# EAGLE design AudioSense-Pi (EAGLE 9.2.0)
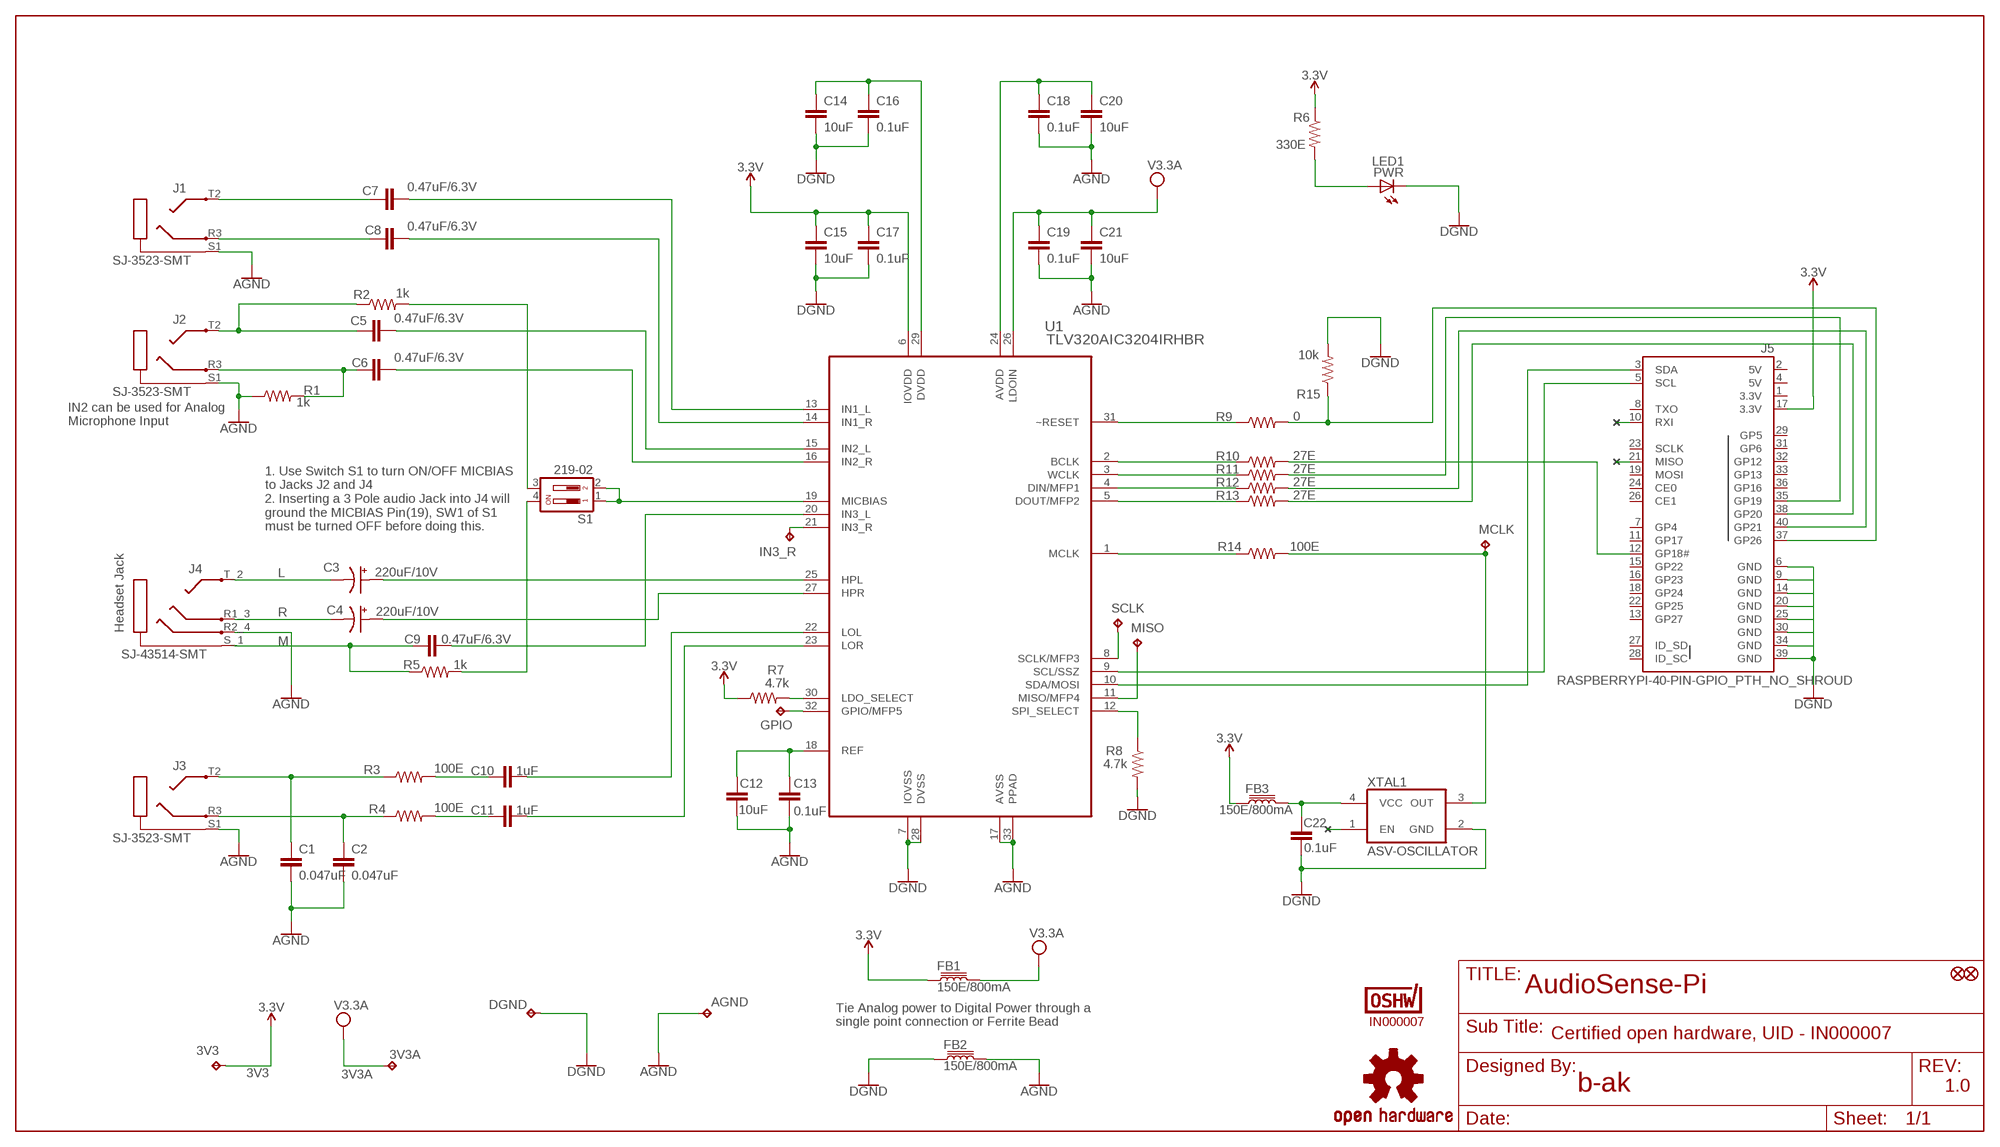
[diagram p0: schematic, sheet 1]

## Parts
3V3  TPB1,27  [B1,27]
3V3A  TPB1,27  [B1,27]
AGND  TPB1,27  [B1,27]
C1  0.047uF  C-EUC1206  [C1206]
C2  0.047uF  C-EUC1206  [C1206]
C3  220uF/10V  T491D107M006AT  [D]
C4  220uF/10V  T491D107M006AT  [D]
C5  0.47uF/6.3V  C-EUC1206  [C1206]
C6  0.47uF/6.3V  C-EUC1206  [C1206]
C7  0.47uF/6.3V  C-EUC1206  [C1206]
C8  0.47uF/6.3V  C-EUC1206  [C1206]
C9  0.47uF/6.3V  C-EUC1206  [C1206]
C10  1uF  C-EUC1206  [C1206]
C11  1uF  C-EUC1206  [C1206]
C12  10uF  C-EUC1206  [C1206]
C13  0.1uF  C-EUC1206  [C1206]
C14  10uF  C-EUC1206  [C1206]
C15  10uF  C-EUC1206  [C1206]
C16  0.1uF  C-EUC1206  [C1206]
C17  0.1uF  C-EUC1206  [C1206]
C18  0.1uF  C-EUC1206  [C1206]
C19  0.1uF  C-EUC1206  [C1206]
C20  10uF  C-EUC1206  [C1206]
C21  10uF  C-EUC1206  [C1206]
C22  0.1uF  C-EUC1206  [C1206]
DGND  TPB1,27  [B1,27]
FB1  150E/800mA  FERRITE_0805MP  [_0805MP]
FB2  150E/800mA  FERRITE_0805MP  [_0805MP]
FB3  150E/800mA  FERRITE_0805MP  [_0805MP]
FID1  FIDUCIAL""  [FIDUCIAL_1MM]
FID2  FIDUCIAL""  [FIDUCIAL_1MM]
GPIO  TPB1,27  [B1,27]
IN3_R  TPB1,27  [B1,27]
J1  SJ-3523-SMT  [SJ-3523-SMT]
J2  SJ-3523-SMT  [SJ-3523-SMT]
J3  SJ-3523-SMT  [SJ-3523-SMT]
J4  SJ-43514-SMT  [SJ-43514-SMT]
J5  RASPBERRYPI-40-PIN-GPIO_PTH_NO_SHROUD  [2X20]
LOGO2  OSHW-LOGOM  [OSHW-LOGO-M]
MCLK  TPB1,27  [B1,27]
MISO  TPB1,27  [B1,27]
PWR  LED1  LEDCHIP-LED0805  [CHIP-LED0805]
R1  1k  RESISTOR1206  [1206]
R2  1k  RESISTOR1206  [1206]
R3  100E  RESISTOR1206  [1206]
R4  100E  RESISTOR1206  [1206]
R5  1k  RESISTOR1206  [1206]
R6  330E  RESISTOR1206  [1206]
R7  4.7k  RESISTOR1206  [1206]
R8  4.7k  RESISTOR1206  [1206]
R9  0  RESISTOR1206  [1206]
R10  27E  RESISTOR1206  [1206]
R11  27E  RESISTOR1206  [1206]
R12  27E  RESISTOR1206  [1206]
R13  27E  RESISTOR1206  [1206]
R14  100E  RESISTOR1206  [1206]
R15  10k  RESISTOR1206  [1206]
S1  219-02  [CTS-219-02]
SCLK  TPB1,27  [B1,27]
U1  TLV320AIC3204IRHBR  [QFN50P500X500X100-33N]
U$6  IN000007  CERT-SMALL  [CERT-SMALL-SILK]
XTAL1  ASV-OSCILLATOR  [OSCILLATOR_7X5_SMD]

## Nets
3POLE_MBIAS: R2.2 S1.3
3V3: 3V3.TP C15.1 C17.1 FB1.1 FB3.1 J5.17(3.3V) R6.1 R7.1 U1.6(IOVDD) ; supply symbol labelled 3.3V
3V3A: 3V3A.TP C19.1 C21.1 FB1.2 U1.26(LDOIN) ; supply symbol labelled V3.3A
4POLE_MBIAS: R5.2 S1.4
AGND: AGND.TP C1.2 C2.2 C12.2 C13.2 C18.2 C19.2 C20.2 C21.2 FB2.2 J1.S1 J2.S1 J3.S1 J4.R2_4 R1.1 U1.17(AVSS) U1.33(PPAD)
AIC_LINE_LOUT_1: C10.1 R3.2
AIC_LINE_ROUT_1: C11.1 R4.2
AVDD: C18.1 C20.1 U1.24(AVDD)
BCLK: R10.1 U1.2(BCLK)
DIN: R12.1 U1.4(DIN/MFP1)
DOUT: R13.1 U1.5(DOUT/MFP2)
DVDD: C14.1 C16.1 U1.29(DVDD)
GND: C14.2 C15.2 C16.2 C17.2 C22.2 DGND.TP FB2.1 J5.6(GND) J5.9(GND) J5.14(GND) J5.20(GND) J5.25(GND) J5.30(GND) J5.34(GND) J5.39(GND) PWR.C R8.2 R15.2 U1.7(IOVSS) U1.28(DVSS) XTAL1.2(GND) ; supply symbol labelled DGND
GP_26: J5.37(GP26) R9.2 R15.1
GPIO: GPIO.TP U1.32(GPIO/MFP5)
HPL: C3.+(A) U1.25(HPL)
HPR: C4.+(A) U1.27(HPR)
IN1_RING: C8.1 J1.R3
IN1_TIP: C7.1 J1.T2
IN1L: C7.2 U1.13(IN1_L)
IN1R: C8.2 U1.14(IN1_R)
IN2_RING: C6.1 J2.R3 R1.2
IN2_TIP: C5.1 J2.T2 R2.1
IN2L: C5.2 U1.15(IN2_L)
IN2R: C6.2 U1.16(IN2_R)
IN3_R: IN3_R.TP U1.21(IN3_R)
IN3L: C9.2 U1.20(IN3_L)
L: C3.-(C) J4.T_2
LDO_SEL: R7.2 U1.30(LDO_SELECT)
LED-A: PWR.A R6.2
LOL: C10.2 U1.22(LOL)
LOR: C11.2 U1.23(LOR)
LOUT_RING: C2.1 J3.R3 R4.1
LOUT_TIP: C1.1 J3.T2 R3.1
M: C9.1 J4.S_1 R5.1
MCLK: R14.1 U1.1(MCLK)
MICBIAS: S1.1 S1.2 U1.19(MICBIAS)
MISO: MISO.TP U1.11(MISO/MFP4)
N$1: XTAL1.1(EN)
N$2: J5.10(RXI)
N$3: J5.21(MISO)
R: C4.-(C) J4.R1_3
REF: C12.1 C13.1 U1.18(REF)
RESET: R9.1 U1.31(~RESET)
RPI_BCLK_PIN12: J5.12(GP18#) R10.2
RPI_DIN_PIN38: J5.38(GP20) R13.2
RPI_DOUT_PIN40: J5.40(GP21) R12.2
RPI_FS_PIN35: J5.35(GP19) R11.2
SCL: J5.5(SCL) U1.9(SCL/SSZ)
SCLK: SCLK.TP U1.8(SCLK/MFP3)
SDA: J5.3(SDA) U1.10(SDA/MOSI)
SPI_SEL: R8.1 U1.12(SPI_SELECT)
VCC: C22.1 FB3.2 XTAL1.4(VCC)
WCLK: R11.1 U1.3(WCLK)
XTAL_OUT: MCLK.TP R14.2 XTAL1.3(OUT)
Unconnected: J5.7(GP4) J5.8(TXO) J5.11(GP17) J5.13(GP27) J5.15(GP22) J5.16(GP23) J5.18(GP24) J5.19(MOSI) J5.22(GP25) J5.23(SCLK) J5.24(CE0) J5.26(CE1) J5.27(ID_SD) J5.28(ID_SC) J5.29(GP5) J5.31(GP6) J5.32(GP12) J5.33(GP13) J5.36(GP16)

## Notes on the sheet
- IN2 can be used for Analog 
  Microphone Input
- 1. Use Switch S1 to turn ON/OFF MICBIAS
  to Jacks J2 and J4
  2. Inserting a 3 Pole audio Jack into J4 will
  ground the MICBIAS Pin(19), SW1 of S1
  must be turned OFF before doing this.
- Headset Jack
- Tie Analog power to Digital Power through a 
  single point connection or Ferrite Bead
- Certified open hardware, UID - IN000007
- b-ak | 1.0

## Power pins joined to a net without a drawn wire
3V3: J5.1(3.3V)
5V: J5.2(5V) J5.4(5V)

## Library data of the parts
3V3 3V3A AGND DGND GPIO IN3_R MCLK MISO SCLK = TLV:TP: Test pad
C1 C2 = resistor:C-EU: CAPACITOR, European symbol; DESCRIPTION: CAP CER 0.047UF 10V X7R 1206; MANUFACTURER: AVX Corporation; MANUFACTURER_PART_NUMBER: 1206ZC473KAT2A; PACKAGE: 1206
C3 C4 = Volks73-Kemet:T491?*: Tantalum Surface Mount Capacitor - Standard Tantalum T491 Series Industrial Grade MnO2 Documentation Datasheet <http://www.kemet.com/Lists/ProductCatalog/Attachments/254/KEM_T2005_T491.pdf> Overview The KEMET T491 Series, designed specifially for today’s highly automated surface mount processes and equipment, is the leading choice for surface mount designs. The T491 combines KEMET’s proven solid tantalum technology, acclaimed and respected throughout the world, with the latest in materials, processes and automation, resulting in unsurpassed total performance and value. This product meets or exceeds the requirements of EIA standard 535BAAC. This series is classifid as MSL (Moisture Sensitivity Level) 1 under J STD 020: unlimited flor life time at ≤30°C / 85% RH. The T491 standard terminations are available in 100% matte tin and provide excellent wetting characteristics and compatibility with today's surface mount solder systems. Tin/lead (Sn/Pb) terminations are available upon request for any part number. Gold-plated terminations are also available for use with conductive epoxy attachment processes. Standard packaging of these devices is tape and reel in accordance with EIA 481. This system provides perfect compatibility with all tape-fed placement units. Benefits Meets or exceeds EIA Standard 535BAAC Taped and reeled per EIA 481 Symmetrical, compliant terminations Optional gold-plated terminations Laser-marked case 100% surge current test on C, D, E, U, V, X sizes Halogen free epoxy Capacitance 0.1 µF to 1,000 µF Tolerance ±10%, ±20% Voltage 2.5 – 50 VDC Extended range values Low profie case sizes RoHS Compliant and lead-free terminations (See www.kemet.com for transition information) Operating temperature: -55ºC to +125ºC; CAPACITANCE: 200µF/10V; CATEGORY: Capacitors; DATASHEET: http://www.kemet.com/Lists/ProductCatalog/Attachments/254/KEM_T2005_T491.pdf; DESCRIPTION: CAP TANT 220UF 10V 10% 2917; DOCUMENTATION_LINK: <a href="http://www.kemet.com/Lists/ProductCatalog/Attachments/254/KEM_T2005_T491.pdf">Datasheet</a>; DOCUMENTATION_URL: http://www.kemet.com/Lists/ProductCatalog/Attachments/254/KEM_T2005_T491.pdf; ESR: 800 mOhm; FAMILY: Tantalum Capacitors; FEATURES: General Purpose; HEIGHT-SEATED: 0.122" (3.10mm); LEAD_SPACING: -; LIFETIME_TEMP: 2000 Hrs @ 85°C; MANUFACTURER: KEMET; MANUFACTURER_PART_NUMBER: T491D227K010AT; MANUFACTURER_SIZE_CODE: D; MOUNTING_TYPE: Surface Mount; OPERATING_TEMPERATURE: -55°C ~ 125°C; PACKAGE: 2917 (7343 Metric); PART_NUMBER: T491D107M006AT; SERIES: T491; SIZE: 0.287" L x 0.169" W (7.30mm x 4.30mm); SUPPLIER_ITEM_INFO: http://www.digikey.com/product-detail/en/T491D107M006AT/399-8367-1-ND/3472090; SUPPLIER_ITEM_LINK: <a href="http://www.digikey.com/product-detail/en/T491D107M006AT/399-8367-1-ND/3472090">Details</a>; SUPPLIER_ITEM_NUMBER: 399-8367-1-ND; SUPPLIER_ITEM_URL: http://www.digikey.com/product-detail/en/T491D107M006AT/399-8367-1-ND/3472090; SUPPLIER_LINK: <a href="http://www.digikey.com">Home Page</a>; SUPPLIER_NAME: Digi-Key; SUPPLIER_URL: http://www.digikey.com; TOLERANCE: ±20%; TYPE: Molded; VOLTAGE-RATED: 6.3V
C5-C9 = resistor:C-EU: CAPACITOR, European symbol; DESCRIPTION: CAP CER 0.47UF 16V X7R 1206; MANUFACTURER: Yageo; MANUFACTURER_PART_NUMBER: CC1206KRX7R7BB474; PACKAGE: 1206
C10 C11 = resistor:C-EU: CAPACITOR, European symbol; DESCRIPTION: CAP CER 1UF 16V X7R 1206; MANUFACTURER: Yageo; MANUFACTURER_PART_NUMBER: CC1206JKX7R7BB105; PACKAGE: 1206
C12 C14 C15 C20 C21 = resistor:C-EU: CAPACITOR, European symbol; DESCRIPTION: CAP CER 10UF 16V X7R 1206; MANUFACTURER: Kemet; MANUFACTURER_PART_NUMBER: C1206C106J4RACTU; PACKAGE: 1206
C13 C16-C19 C22 = resistor:C-EU: CAPACITOR, European symbol; DESCRIPTION: CAP CER 0.1UF 16V X7R 1206; MANUFACTURER: Kemet; MANUFACTURER_PART_NUMBER: C1206C104K4RACTU; PACKAGE: 1206
FB1-FB3 = TLV:FERRITE: Ferrite Bead 0603 MMZ1608B121C - 120 Ohm @ 100MHz, 600mA, 0.15 Ohm DC Resistance - Digikey: 445-2164-1-ND BK1608HW121-T - 120 Ohm, 600mA Ferrite Chip - Digikey: 587-1876-2-ND 0805 BLM21AG151SN1D - FERRITE BEAD 150 OHM 0805 1LN (Murrata Electronics) HZ0805B272R-10 - 2.7K Ohm @ 100MHz, 200mA, 0.8 Ohm DC Resistance - Digikey: 240-2504-1-ND (see also Murata BLM21BD272SN1L) MMZ2012Y152B - 1.5K Ohm @ 100MHz, 500mA, 0.4 Ohm DC Resistance - Digikey: 445-1560-1-ND - Mainly for high frequency (80-400MHz) MMZ2012R102A - 1K Ohm @ 100MHz, 500mA, 0.3 Ohm DC Resistance - Digikey: 445-1555-2-ND - More general purpose (10-200MHz); DESCRIPTION: FERRITE BEAD 150 OHM 0805 1LN; MANUFACTURER: Murata Electronics North America; MANUFACTURER_PART_NUMBER: BLM21AG151SN1D; PACKAGE: 0805 (2012 Metric); PART_DESCRIPTION: FERRITE BEAD 150 OHM 0805 1LN; PART_NUMBER: BLM21AG151SN1D
FID1 FID2 = microbuilder:FIDUCIAL: Fiducial Alignment Points Various fiducial points for machine vision alignment.
J1-J3 = TLV:SJ-3523-SMT: 3.5mm Stereo Jack without Tip Switch from CUI Inc; 3D-MODEL: http://www.cui.com/product/resource/3dmodel/sj-3523-smt; DATASHEET: http://www.cui.com/product/resource/sj-352x-smt-series.pdf; DESCRIPTION: CONN JACK STEREO 3.5MM SMD R/A; LINK: https://www.arrow.com/en/products/sj-3523-smt-tr/cui-inc; MANUFACTURER: CUI Inc.; MANUFACTURER_PART_NUMBER: SJ-3523-SMT-TR; PACKAGE: Surface Mount, Right Angle; PART_DESC: 3.5MM Stereo Jack, SMD RA; PART_NUMBER: SJ-3523-SMT
J4 = TLV:SJ-43514-SMT: 4 Conductors (TRRS), 4 Contacts, 3.5mm Stereo Jack from CUI Inc; 3D-MODEL: http://www.cui.com/product/resource/3dmodel/sj-43514-smt; DATASHEET: http://www.cui.com/product/resource/digikeypdf/sj-4351x-smt_series.pdf; DESCRIPTION: CONN JACK 4COND 3.5MM SMD R/A; LINK: https://www.arrow.com/en/products/sj-43516-smt-tr/cui-inc; MANUFACTURER: CUI Inc.; MANUFACTURER_PART_NUMBER: SJ-43514-SMT-TR; PACKAGE: Surface Mount, Right Angle; PART-NUMBER: SJ-43514-SMT-TR
J5 = SparkFun-Connectors:RASPBERRYPI-40-PIN-GPIO: Raspberry Pi GPIO Header 2x20 pin connector, as found on B, B+, A+ models. Both shrouded PTH and SMT versions available. SparkFun Products: GPIO Shrouded Header <https://www.sparkfun.com/products/13054>- PTH SparkFun Pi Wedge (Preassembled) <https://www.sparkfun.com/products/13717>; DESCRIPTION: Stacking Header for Pi A+/B+/Pi 2/Pi 3 - 2x20 Extra Tall Header; MANUFACTURER: Adafruit; MANUFACTURER_PART_NUMBER: 1979; PACKAGE: PTH
LOGO2 = SparkFun-Aesthetics:OSHW-LOGO: Open-Source Hardware (OSHW) Logo This logo indicates the piece of hardware it is found on incorporates a OSHW license and/or adheres to the definition of open source hardware found here: http://freedomdefined.org/OSHW
PWR = adafruit:LED: LED OSRAM: - CHIPLED LG R971, LG N971, LY N971, LG Q971, LY Q971, LO R971, LY R971 LH N974, LH R974 LS Q976, LO Q976, LY Q976 LO Q996 - Hyper CHIPLED LW Q18S LB Q993, LB Q99A, LB R99A - SideLED LS A670, LO A670, LY A670, LG A670, LP A670 LB A673, LV A673, LT A673, LW A673 LH A674 LY A675 LS A676, LA A676, LO A676, LY A676, LW A676 LS A679, LY A679, LG A679 - Hyper Micro SIDELED® LS Y876, LA Y876, LO Y876, LY Y876 LT Y87S - SmartLED LW L88C, LW L88S LB L89C, LB L89S, LG L890 LS L89K, LO L89K, LY L89K LS L896, LA L896, LO L896, LY L896 - TOPLED LS T670, LO T670, LY T670, LG T670, LP T670 LSG T670, LSP T670, LSY T670, LOP T670, LYG T670 LG T671, LOG T671, LSG T671 LB T673, LV T673, LT T673, LW T673 LH T674 LS T676, LA T676, LO T676, LY T676, LB T676, LH T676, LSB T676, LW T676 LB T67C, LV T67C, LT T67C, LS T67K, LO T67K, LY T67K, LW E67C LS E67B, LA E67B, LO E67B, LY E67B, LB E67C, LV E67C, LT E67C LW T67C LS T679, LY T679, LG T679 LS T770, LO T770, LY T770, LG T770, LP T770 LB T773, LV T773, LT T773, LW T773 LH T774 LS E675, LA E675, LY E675, LS T675 LS T776, LA T776, LO T776, LY T776, LB T776 LHGB T686 LT T68C, LB T68C - Hyper Mini TOPLED® LB M676 - Mini TOPLED Santana® LG M470 LS M47K, LO M47K, LY M47K Source: http://www.osram.convergy.de/; DESCRIPTION: LED GREEN CLEAR 1206 SMD; MANUFACTURER: Lite-On Inc.; MANUFACTURER_PART_NUMBER: LTST-C150GKT; PACKAGE: 1206
R1 R2 R5 = SparkFun-Resistors:RESISTOR: Generic Resistor Package; DESCRIPTION: RES SMD 1K OHM 1% 1/4W 1206; MANUFACTURER: Yageo; MANUFACTURER_PART_NUMBER: RC1206FR-071KL; PACKAGE: 1206
R3 R4 R14 = SparkFun-Resistors:RESISTOR: Generic Resistor Package; DESCRIPTION: RES SMD 100 OHM 1% 1/4W 1206; MANUFACTURER: Yageo; MANUFACTURER_PART_NUMBER: RC1206FR-07100RL; PACKAGE: 1206
R6 = SparkFun-Resistors:RESISTOR: Generic Resistor Package; DESCRIPTION: RES SMD 330 OHM 5% 1/4W 1206; MANUFACTURER: Yageo; MANUFACTURER_PART_NUMBER: RC1206JR-07330RL; PACKAGE: 1206
R7 R8 = SparkFun-Resistors:RESISTOR: Generic Resistor Package; DESCRIPTION: RES SMD 4.7K OHM 1% 1/4W 1206; MANUFACTURER: Yageo; MANUFACTURER_PART_NUMBER: RC1206FR-074K7L; PACKAGE: 1206
R9 = SparkFun-Resistors:RESISTOR: Generic Resistor Package; DESCRIPTION: RES SMD 0 OHM JUMPER 1/4W 1206; MANUFACTURER: Yageo; MANUFACTURER_PART_NUMBER: AC1206JR-070RL; PACKAGE: 1206
R10-R13 = SparkFun-Resistors:RESISTOR: Generic Resistor Package; DESCRIPTION: RES SMD 27 OHM 5% 1/4W 1206; MANUFACTURER: Yageo; MANUFACTURER_PART_NUMBER: RC1206JR-0727RL; PACKAGE: 1206
R15 = SparkFun-Resistors:RESISTOR: Generic Resistor Package; DESCRIPTION: RES SMD 10K OHM 1% 1/4W 1206; MANUFACTURER: Yageo; MANUFACTURER_PART_NUMBER: RC1206FR-0710KP; PACKAGE: 1206
S1 = TLV:219-02*: Surface Mount DIP Switch Series 219 SMT CTS Electronic Components Source: www.ctscorp.com; DATASHEET: https://www.ctscorp.com/wp-content/uploads/219.pdf; DESCRIPTION: SWITCH SLIDE DIP SPST 100MA 20V; LINK: https://www.arrow.com/en/products/219-2lpst/cts; MANUFACTURER: CTS Electrocomponents; MANUFACTURER_PART_NUMBER: 219-2LPSTR; PACKAGE: SMT
U1 = TLV:TLV320AIC3204IRHBR: Ultra Low Power Stereo Audio Codec; DESCRIPTION: IC STEREO AUDIO CODEC 1.8V 32QFN; MANUFACTURER: Texas Instruments; MANUFACTURER_PART_NUMBER: TLV320AIC3204IRHBR; MPN: TLV320AIC3204IRHBR; OC_FARNELL: 1682562; OC_NEWARK: 09P8706; PACKAGE: 32-VFQFN Exposed Pad; SUPPLIER: Texas Instruments
U$6 = OSHWA:CERT
XTAL1 = asv-oscillator:ASV-OSCILLATOR: Oscillator; DESCRIPTION: OSC XO 12.000MHZ HCMOS SMD; MANUFACTURER: Abracon LLC; MANUFACTURER_PART_NUMBER: ASV-12.000MHZ-EJ-T; PACKAGE: 1206

## Board
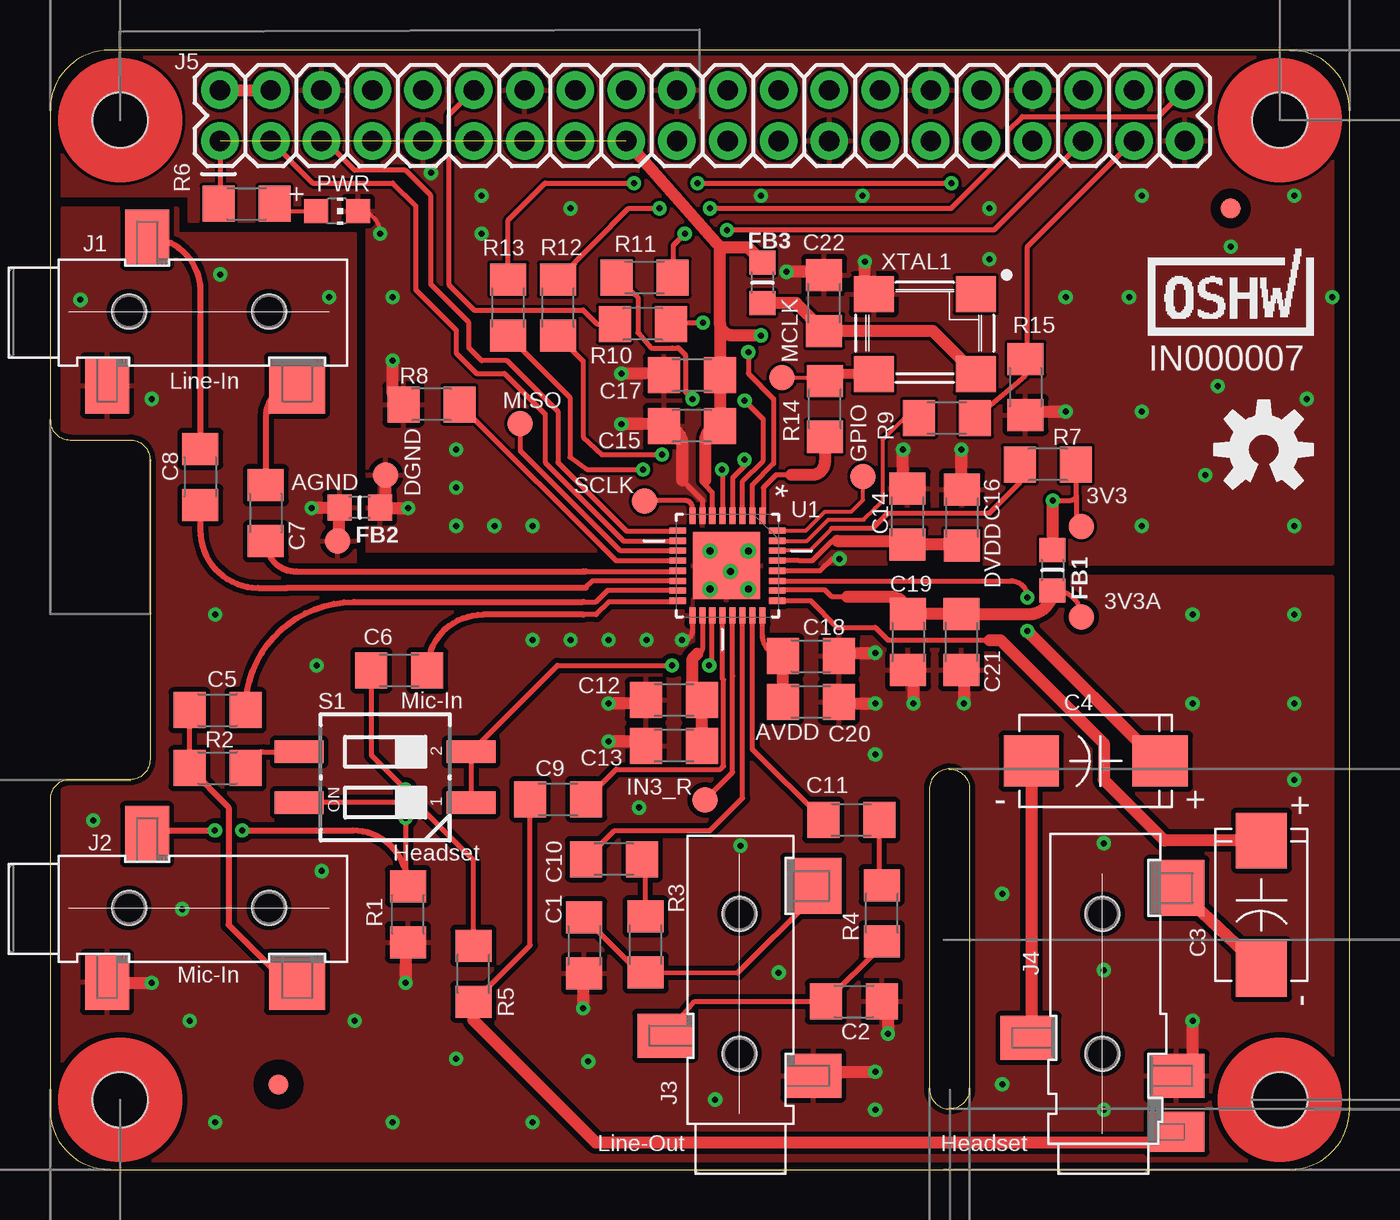
[diagram p1: board, top side]
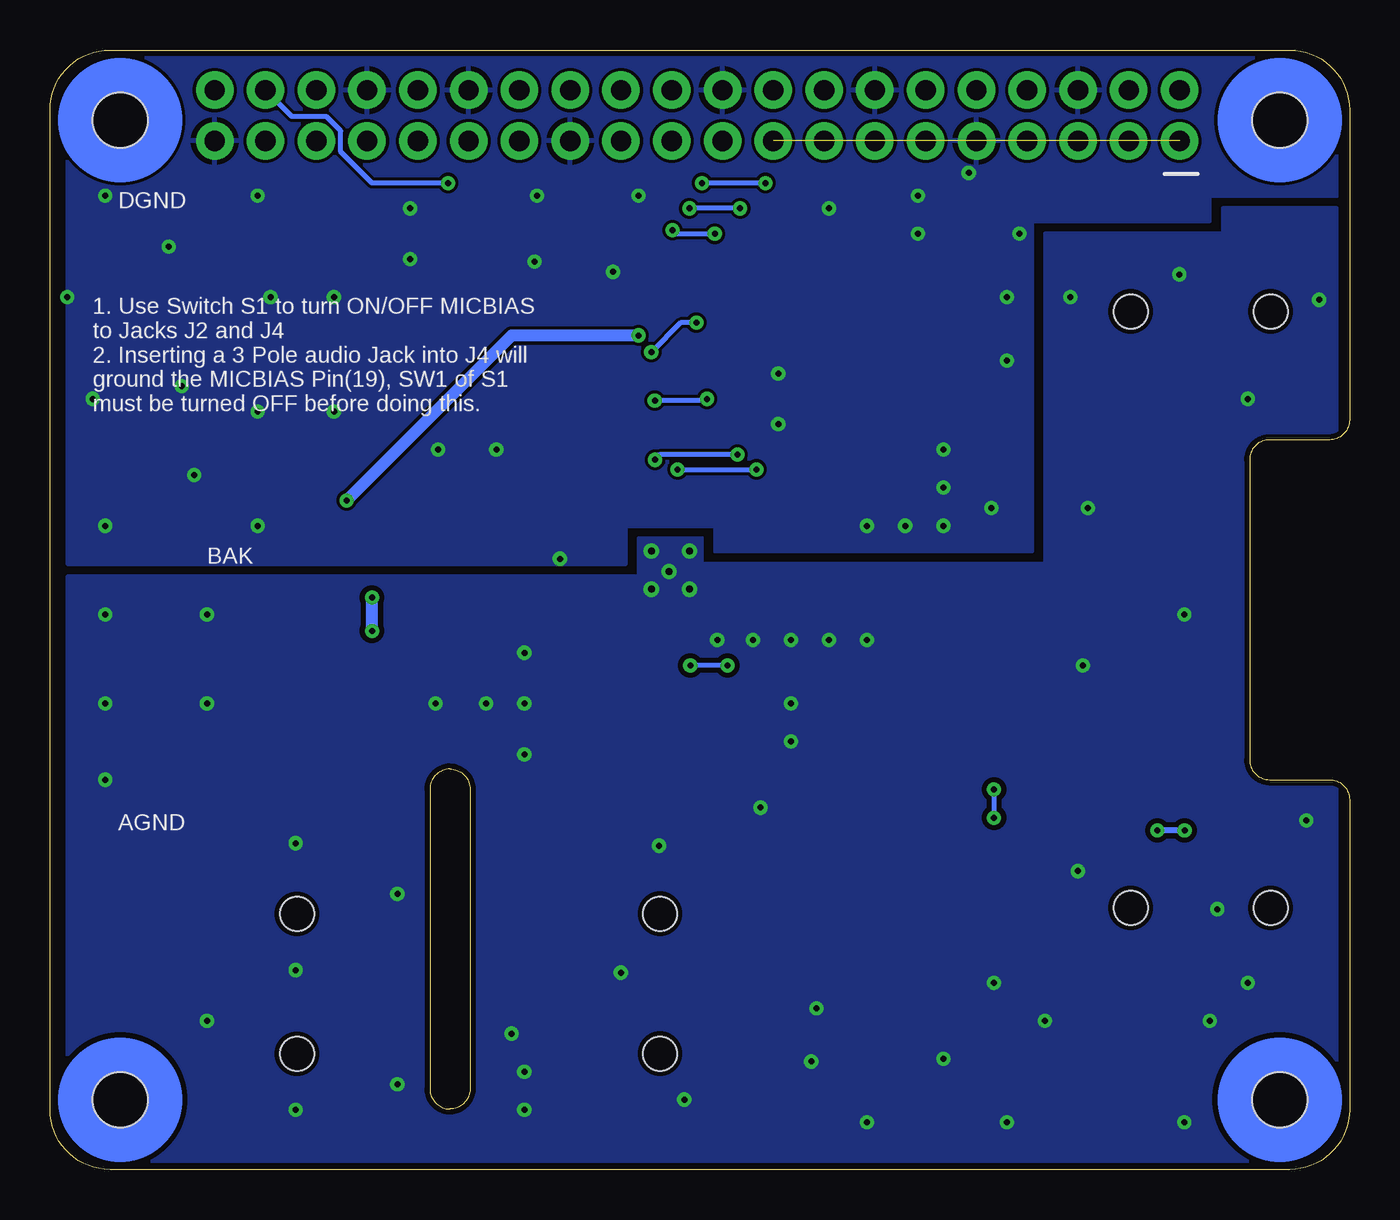
[diagram p2: board, bottom side, seen from below]

Size 65 x 56 mm. Coordinates in mm from the lower left corner, seen from the top.
Outline: 0,53 0,37.5 arc90 1,36.5 4,36.5 arc-90 5,35.5 5,20.5 arc-90 4,19.5 1,19.5 arc90 0,18.5 0,3 arc90 3,0 62,0 arc90 65,3 65,53 arc90 62,56 3,56 arc90 0,53
Outline: 43.99,19.03 43.99,4.03 arc90 44.99,3.03 arc90 45.99,4.03 45.99,19.03 arc90 44.99,20.03 arc90 43.99,19.03
Copper layers (1*16): Top 0.035mm / dielectric 1.5mm / Bottom 0.035mm
Design rules "bc": minimum track width 8mil, minimum drill 0.3mm, track to track 6mil, track to pad 6mil, pad to pad 6mil, via to via 6mil, smd to smd 6mil, copper to edge 10mil, drill to drill 8mil, minimum pad ring 10mil, minimum via ring 8mil, stop-mask expansion 4mil, vias tented up to drill 15mil, thermal gap 10mil
Holes 2.75 mm at 3.5,52.5 61.5,52.5 61.5,3.5 3.5,3.5

### Footprints (pad centres in the part's own frame; a part is rotated, then mirrored left to right if it is on the bottom)
B1,27 = smd 1.27 x 1.27: TP 0,0
C1206 = smd 1.6 x 1.8: 1 -1.4,0; 2 1.4,0
D = smd 2.77 x 2.55: + 3.22,0; - -3.22,0
_0805MP = smd 1.2 x 1.3: 1 -1.016,0; 2 1.016,0
FIDUCIAL_1MM = smd 1 x 1: 1 0,0
SJ-3523-SMT = smd 2.2 x 2.8: R3 -1.5,4.9; S1 -3.5,-2.5 | smd 2.8 x 2.8: T2 6,-2.5 | hole 1.7: 4.6,1.2; -2.4,1.2
SJ-43514-SMT = smd 2.2 x 2.8: R1_3 -0.6,4.9; R2_4 -2.5,-2.5 | smd 2 x 2.8: S_1 -5.3,-2.5 | smd 2.8 x 2.8: T_2 6.9,-2.5 | hole 1.7: 5.6,1.2; -1.4,1.2
2X20 = drill 1.016 pad 1.88: 1 0,0; 2 0,2.54; 3 2.54,0; 4 2.54,2.54; 5 5.08,0; 6 5.08,2.54; 7 7.62,0; 8 7.62,2.54; 9 10.16,0; 10 10.16,2.54; 11 12.7,0; 12 12.7,2.54; 13 15.24,0; 14 15.24,2.54; 15 17.78,0; 16 17.78,2.54; 17 20.32,0; 18 20.32,2.54; 19 22.86,0; 20 22.86,2.54; 21 25.4,0; 22 25.4,2.54; 23 27.94,0; 24 27.94,2.54; 25 30.48,0; 26 30.48,2.54; 27 33.02,0; 28 33.02,2.54; 29 35.56,0; 30 35.56,2.54; 31 38.1,0; 32 38.1,2.54; 33 40.64,0; 34 40.64,2.54; 35 43.18,0; 36 43.18,2.54; 37 45.72,0; 38 45.72,2.54; 39 48.26,0; 40 48.26,2.54
CHIP-LED0805 = smd 1.2 x 1.2: A 0,-1.05; C 0,1.05
1206 = smd 1.6 x 1.8: 1 -1.4,0; 2 1.4,0
CTS-219-02 = smd 1.13 x 2.44: 1 -1.27,-4.3; 2 1.27,-4.3; 3 1.27,4.3; 4 -1.27,4.3
QFN50P500X500X100-33N = smd 0.813 x 0.305: 1 -2.489,1.753; 2 -2.489,1.245; 3 -2.489,0.762; 4 -2.489,0.254; 5 -2.489,-0.254; 6 -2.489,-0.762; 7 -2.489,-1.245; 8 -2.489,-1.753; 17 2.489,-1.753; 18 2.489,-1.245; 19 2.489,-0.762; 20 2.489,-0.254; 21 2.489,0.254; 22 2.489,0.762; 23 2.489,1.245; 24 2.489,1.753 | smd 0.305 x 0.813: 9 -1.753,-2.489; 10 -1.245,-2.489; 11 -0.762,-2.489; 12 -0.254,-2.489; 13 0.254,-2.489; 14 0.762,-2.489; 15 1.245,-2.489; 16 1.753,-2.489; 25 1.753,2.489; 26 1.245,2.489; 27 0.762,2.489; 28 0.254,2.489; 29 -0.254,2.489; 30 -0.762,2.489; 31 -1.245,2.489; 32 -1.753,2.489 | smd 3.353 x 3.353: 33 0,-0.051
OSCILLATOR_7X5_SMD = smd 2 x 1.8: 1 -2.6,-1.9; 2 2.5,-1.9; 3 2.5,2.1; 4 -2.6,2.1

### Placement (x,y rotation side)
3V3  51.59,32.16 0 top
3V3A  51.59,27.64 0 top
AGND  14.38,31.44 0 top
C1  26.72,11.21 270 top
C2  40.21,8.4 0 top
C3  60.59,13.24 90 top
C4  52.31,20.44 0 top
C5  8.38,22.98 0 top
C6  17.46,24.97 0 top
C7  10.79,32.83 270 top
C8  7.51,34.65 270 top
C9  25.42,18.52 0 top
C10  28.2,15.52 180 top
C11  40.08,17.48 180 top
C12  31.21,23.48 180 top
C13  31.21,21.2 180 top
C14  42.89,32.67 90 top
C15  32.11,37.2 180 top
C16  45.62,32.61 90 top
C17  32.11,39.73 180 top
C18  38.07,25.68 0 top
C19  42.92,26.38 270 top
C20  38.06,23.4 0 top
C21  45.58,26.38 270 top
C22  38.71,43.34 90 top
DGND  16.79,34.74 0 top
FB1  50.14,29.98 270 top
FB2  15.49,33.11 180 top
FB3  35.63,44.35 270 top
FID1  59.05,48.08 0 top
FID2  11.43,4.26 0 top
GPIO  40.66,34.66 0 top
IN3_R  32.77,18.48 0 top
J1  6.35,41.72 0 top
J2  6.35,11.88 0 top
J3  35.69,8.2 90 top
J4  53.85,7.18 90 top
J5  8.5,51.45 0 top
LOGO2  60.71,36.01 0 top
MCLK  36.6,39.62 0 top
MISO  23.52,37.31 0 top
PWR  14.35,47.95 270 top
R1  17.91,12.77 90 top
R2  8.38,20.08 0 top
R3  29.79,11.25 90 top
R4  41.6,12.82 90 top
R5  21.18,9.8 90 top
R6  9.83,48.31 0 top
R7  49.91,35.27 180 top
R8  19.09,38.27 180 top
R9  44.87,37.6 0 top
R10  29.65,42.3 180 top
R11  29.75,44.62 0 top
R12  25.41,43.12 90 top
R13  22.92,43.12 90 top
R14  38.76,38.05 90 top
R15  48.79,39.15 270 top
S1  16.76,19.63 90 top
SCLK  29.74,33.44 0 top
U1  33.88,30.2 270 top
U$6  59.05,41.72 0 top
XTAL1  43.71,41.89 180 top

### Tracks (layer width: path | path; a pad name or v marks a point on that pad's centre or on a via)
3POLE_MBIAS
  Top 0.254: R2.2 arc-90 10.62,20.9 S1.3
3V3  (via drill 0.3)  (1 unrouted)
  Top 0.203: 8.5,48.39 arc-90 R6.1
  Top 0.254: v50.16,33.47 51.05,33.47 arc90 51.33,33.75 | 51.33,33.75 R7.1 | U1.6 33.12,33.88 32.77,34.23 32.77,34.49 | J5.1 8.5,48.39 | 51.33,33.75 51.33,32.41 arc90 3V3.TP
  Top 0.61: J5.17 33.51,46.13 | v50.16,33.47 50.16,31.02 FB1.1 | 33.51,46.13 34.88,46.13 FB3.1 | 32.77,34.49 32.77,36.46 arc-90 C15.1 C17.1 33.51,42.36 | 33.51,42.36 33.51,46.13 | v35.56,41.72 34.14,41.72 arc-90 33.51,42.36
  Bottom 0.61: v35.56,41.72 41.91,41.72 v50.16,33.47
3V3A
  Top 0.254: 50.27,28.97 FB1.2 50.27,28.97 | 39.88,28.64 39.12,28.64 38.77,28.99 36.4,28.99 U1.26 | 50.27,28.97 arc-90 3V3A.TP
  Top 0.61: FB1.2 arc-90 48.95,27.78 C21.1 C19.1 arc90 42.05,28.64 39.88,28.64
4POLE_MBIAS
  Top 0.254: R5.2 21.18,15.46 18.29,18.36 S1.4
5V
  Top 0.61: J5.2 J5.4
AGND  (via drill 0.3, 0.35)
  Top 0.254: U1.17 32.13,26.89 arc-90 v31.62,26.48
  Top 0.61: C12.2 29.81,23.31 v27.94,23.31 | C13.2 29.81,21.41 v27.94,21.41 | 14.47,33.09 FB2.2 14.45,33.09 | J1.S1 2.85,39.82 | C18.2 arc-90 39.63,25.85 v41.27,25.85 | C20.2 arc90 39.55,23.31 v41.27,23.31 | C19.2 arc-90 43.18,24.72 v43.18,23.31 | C21.2 arc-90 45.72,24.84 v45.72,23.31 | 14.45,33.09 v13.08,33.09 | R1.1 arc90 17.78,11.22 v17.78,9.34 | J2.S1 arc90 2.89,9.34 v5.08,9.34 | J3.S1 arc90 38.24,4.9 v41.27,4.9 | J4.R2_4 arc90 57.15,5.74 v57.15,7.44 | C2.2 arc-90 41.91,8.1 v41.91,6.8 | C1.2 arc90 26.67,9.76 v26.67,8.07 | U1.33 33.74,30.2 v33.02,30.93 | AGND.TP arc90 14.45,31.52 14.45,33.09
  other vias: 5.08,38.55 34.92,30.93 34.04,29.91 33.02,29.03 34.92,29.03 8.26,27.75 57.15,27.75 62.23,27.75 62.23,23.31 57.15,23.31 62.23,19.5 29.84,26.48 27.94,26.48 26.04,26.48 24.13,26.48 13.34,25.22 6.99,7.44 15.24,7.44 41.27,20.77 20.32,5.53 8.26,2.35 17.14,2.35 24.13,2.35 52.7,2.99 52.7,9.98 52.7,16.33 13.97,43.63 34.54,16.2 36.45,9.85 33.27,3.5 29.46,18.1 13.59,14.93 6.6,13.02 2.16,17.47 8.51,44.77 1.52,43.5 47.62,4.26 47.62,13.78 41.27,2.99 26.92,5.4
  pour Bottom (isolate 0.254): 61.13,0.45 3.63,0.45 arc-90 0.64,3.45 0.64,48.08 6.35,48.08 6.35,46.81 15.24,46.81 15.24,30.3 32.38,30.3 32.38,31.56 35.56,31.56 35.56,29.66 64.14,29.66 64.14,3.45 arc-90
  pour Top (isolate 0.254): 0.64,46.81 0.64,48.08 6.35,48.08 6.35,46.81 15.24,46.81 15.24,30.3 32.38,30.3 32.38,31.56 35.56,31.56 35.56,29.66 64.14,29.66 64.14,3.45 arc-90 61.13,0.45 3.63,0.45 arc-90 0.64,3.45
AIC_LINE_LOUT_1
  Top 0.254: R3.2 29.79,15.34 C10.1
AIC_LINE_ROUT_1
  Top 0.254: R4.2 41.48,14.37 C11.1
AVDD
  Top 0.254: C18.1 arc-90 35.64,26.71 U1.24
  Top 0.61: C20.1 arc90 C20.1 C18.1
BCLK  (via drill 0.3)
  Top 0.203: 36.2,35.38 36.2,35.31
  Top 0.254: R10.1 arc-90 31.14,42.36 v32.67,42.36 | U1.2 35.13,34.24 36.2,35.31 | v34.92,40.89 34.92,39.82 36.2,38.55 36.2,35.38
  Bottom 0.254: v32.67,42.36 33.45,42.36 v34.92,40.89
DIN  (via drill 0.3)
  Top 0.254: R12.1 26.67,40.44 26.67,36.64 27.61,35.76 v30.61,35.76 | U1.4 34.14,34.59 34.73,35.18 v34.73,35.5
  Bottom 0.254: v30.61,35.76 34.48,35.76 arc-90 v34.73,35.5
DOUT  (via drill 0.3)
  Top 0.203: U1.5 arc-90 33.61,32.72
  Top 0.254: R13.1 26.01,38.61 26.01,35.63 26.85,35.02 v29.67,35.02 | U1.5 33.66,32.72 33.66,34.97 arc90 v33.6,35.02
  Bottom 0.254: v33.6,35.02 v29.67,35.02
DVDD
  Top 0.203: 37.63,30.46 37.47,30.46 | 38.85,31.18 38.86,31.18 | 39.12,31.44 39.37,31.44
  Top 0.254: U1.29 37.47,30.46 38.13,30.46 38.85,31.18 | 38.86,31.18 39.12,31.44
  Top 0.61: C16.1 arc90 45.56,31.27 C14.1 arc90 42.72,31.44 39.37,31.44
GND  (via drill 0.3)
  Top 0.203: PWR.C arc-90 16.51,46.84 v16.51,46.81
  Top 0.254: 31.62,34.49 31.88,34.23 31.88,34.22 32.64,33.46 U1.7 | U1.28 38.52,29.95 39.12,30.55 v39.5,30.55
  Top 0.61: C17.2 arc90 30.62,39.82 v28.57,39.82 | v28.57,37.28 30.62,37.28 arc-90 C15.2 arc-90 31.62,36.28 31.62,34.49 | 42.8,34.16 arc90 C14.2 arc-90 42.8,34.16 | 42.8,34.16 arc-90 42.67,34.28 v42.67,36.01 | C16.2 arc-90 45.59,34.04 v45.59,36.01 | C22.2 arc90 38.55,44.9 v36.83,44.9 | XTAL1.2 arc-90 40.77,44.23 v40.77,45.41 | FB2.1 16.53,33.09 v17.91,33.09 | FB2.1 16.79,33.39 | R15.2 48.98,37.92 v50.8,37.92 | R8.2 17.14,38.79 v17.14,40.45 | FB2.1 arc90 16.79,33.39 | 16.79,33.39 DGND.TP
  other vias: 58.42,39.19 64.14,43.63 53.98,43.63 57.78,34.74 62.23,32.2 54.61,37.92 62.87,38.55 54.61,32.2 54.61,48.71 62.23,48.71 59.05,46.17 21.59,48.71 22.23,32.2 17.14,43.63 50.8,43.63 21.59,46.81 20.32,36.01 20.32,32.2 24.13,32.2 20.32,34.11 46.99,45.53 26.04,48.08 40.64,48.71 35.56,48.71 46.99,48.08 19.05,49.85
  pour Bottom: 0.64,48.71 0.64,52.69 arc-90 3.63,55.69 61.13,55.69 arc-90 64.14,52.69 64.14,30.3 36.2,30.3 36.2,32.2 31.75,32.2 31.75,30.93 15.88,30.93 15.88,47.44 6.99,47.44 6.99,48.71
  pour Top: 0.64,48.71 0.64,52.69 arc-90 3.63,55.69 61.13,55.69 arc-90 64.14,52.69 64.14,30.3 36.2,30.3 36.2,32.2 31.75,32.2 31.75,30.93 15.88,30.93 15.88,47.44 6.99,47.44 6.99,48.71
GP_26
  Top 0.254: R9.2 48.77,39.69 R15.1 48.9,40.67 48.9,46.17 54.17,51.45 J5.37
GPIO
  Top 0.203: U1.32 37.81,31.96 38.76,32.91 40.08,32.91 40.66,33.5 GPIO.TP
HPL
  Top 0.254: U1.25 38.04,28.45 39.37,27.12 41.27,27.12 41.91,26.48 46.99,26.48
  Top 0.61: C3.+ 55.75,16.46 52.7,19.5 52.7,21.32 47.54,26.48 46.99,26.48
HPR  (via drill 0.3)
  Top 0.254: v48.9,28.61 arc90 48.07,29.44 U1.27
  Top 0.61: v48.9,26.94 55.4,20.44 C4.+
  Bottom 0.61: v48.9,26.94 v48.9,28.61
IN1_RING
  Top 0.305: J1.R3 arc-90 7.51,43.96 C8.1
IN1_TIP
  Top 0.305: J1.T2 arc90 10.79,37.67 C7.1
IN1L
  Top 0.254: 26.67,29.91 31.36,29.91 U1.13
  Top 0.305: 26.8,29.91 26.67,29.91 12.32,29.91 arc-90 C7.2
IN1R
  Top 0.254: U1.14 27.14,29.44 26.8,29.1
  Top 0.305: 26.8,29.1 11.86,29.1 arc-90 11.86,29.1 10.4,29.1 arc-90 7.51,31.98 C8.2
IN2_RING  (via drill 0.3)
  Top 0.254: C6.1 16.06,20.73 v17.78,19.02 | v17.78,17.59 17.78,14.32 R1.2
  Top 0.305: J2.R3 arc-90 5.03,16.96 v8.25,16.96 | v9.62,16.96 15.14,16.96 arc-90 R1.2
  Bottom 0.254: v17.78,19.02 v17.78,17.59
  Bottom 0.305: v8.25,16.96 v9.62,16.96
IN2_TIP
  Top 0.254: R2.1 arc90 6.98,20.11 C5.1
  Top 0.305: R2.1 8.93,18.11 8.93,12.24 11.8,9.38 J2.T2
IN2L
  Top 0.254: 26.67,28.39 27.3,28.39 27.9,28.99 31.37,28.99 U1.15
  Top 0.305: C5.2 arc-90 15.19,28.39 26.67,28.39
IN2R
  Top 0.254: U1.16 31.33,28.39 27.95,28.39 27.32,27.75 26.67,27.75
  Top 0.305: C6.2 arc-90 21.65,27.75 26.67,27.75
IN3_R
  Top 0.254: U1.21 34.14,24.69 34.15,24.69 34.15,19.87 IN3_R.TP
IN3L
  Top 0.254: C9.2 28.32,20.02 33.53,20.02 33.69,20.18 33.69,24.5 33.63,24.56 U1.20
L
  Top 0.61: J4.T_2 60.59,10.09 C3.-
LDO_SEL
  Top 0.203: 39.11,32.07 38,30.97 U1.30
  Top 0.254: 39.11,32.07 41.15,32.07 41.91,32.83 46.99,32.83 48.49,34.33 R7.2
LED-A
  Top 0.203: R6.2 arc90 11.61,47.95 PWR.A
LOL
  Top 0.254: C10.2 28.24,16.96 33.02,16.96 34.65,18.59 U1.22
LOR
  Top 0.254: C11.2 35.13,21.02 U1.23
LOUT_RING
  Top 0.254: J3.R3 32.24,8.4 C2.1 41.6,11.2 R4.1
LOUT_TIP
  Top 0.254: C1.1 29.5,9.83 R3.1 34.4,9.83 38.19,13.62 J3.T2
M
  Top 0.254: R5.1 24.02,11.21 C9.1
  Top 0.61: J4.S_1 55.56,1.35 27.3,1.35 21.18,7.47 R5.1
MCLK
  Top 0.203: 35.69,32.74 arc-90 U1.1
  Top 0.254: 37.08,34.74 36.32,34.74 35.69,34.11 35.69,32.74
  Top 0.61: R14.1 38.76,35.39 arc-90 38.1,34.74 37.08,34.74
MICBIAS  (via drill 0.3)
  Top 0.254: v31.11,25.22 25.38,25.22 S1.2 S1.1 | v32.97,25.22 33.12,25.36 U1.19
  Bottom 0.254: v31.11,25.22 v32.97,25.22
MISO
  Top 0.254: 31.36,30.93 U1.11 28.52,30.97 23.52,35.96 MISO.TP
R
  Top 0.61: C4.- 49.09,6.98 J4.R1_3
REF
  Top 0.203: U1.18
  Top 0.254: 32.38,25.6 32.38,25.81 32.38,25.85 arc90 32.64,26.1 U1.18
  Top 0.61: 32.38,21.42 arc90 C13.1 C12.1 32.14,23.95 32.14,25.56 32.38,25.81
RESET
  Top 0.203: U1.31 37.87,31.45 38.93,32.5 40.69,32.5 41.27,33.09 41.66,33.47 41.66,36.52 42.73,37.6 R9.1
RPI_BCLK_PIN12
  Top 0.254: J5.12 19.94,52.73 19.94,44.27 21.21,43 26.67,43 27.37,42.3 R10.2
RPI_DIN_PIN38  (via drill 0.3)
  Top 0.254: R13.2 22.92,47.5 24.77,49.34 v29.21,49.34 | v32.38,49.34 v45.09,49.34
  Bottom 0.254: v29.21,49.34 v32.38,49.34 | v45.09,49.34 48.9,49.34 50.46,50.91 50.46,51.95 51.17,52.67 52.9,52.67 J5.38
RPI_DOUT_PIN40  (via drill 0.3)
  Top 0.254: R12.2 28.95,48.08 v30.48,48.08 | v33.02,48.08 45.09,48.08 47.92,50.91 47.92,51.95 48.63,52.67 55.44,52.67 J5.40
  Bottom 0.254: v30.48,48.08 v33.02,48.08
RPI_FS_PIN35  (via drill 0.3)
  Top 0.254: J5.35 47.22,46.99 v33.86,46.99 | v31.75,46.81 31.17,46.22 R11.2
  Bottom 0.254: v33.86,46.99 33.68,46.81 v31.75,46.81
SCL
  Top 0.254: U1.9 31.38,31.95 28.83,31.95 25.4,35.38 25.4,37.92 22.86,40.45 21.59,40.45 20.95,41.09 20.95,42.36 19.05,44.27 19.05,48.71 17.78,49.98 15.24,49.98 13.77,51.45 J5.5
SCLK
  Top 0.254: U1.8 32.13,33.09 arc90 31.75,33.47 29.77,33.47 arc90 SCLK.TP
SDA
  Top 0.254: J5.3 13.14,49.34 17.14,49.34 18.29,48.2 18.29,44.01 20.32,41.98 20.32,40.84 21.34,39.82 22.73,39.82 24.77,37.79 24.77,35.38 24.94,35.2 24.94,35.19 28.68,31.45 U1.10
SPI_SEL
  Top 0.254: R8.1 28.32,30.46 U1.12
VCC
  Top 0.61: XTAL1.4 44.15,41.94 C22.1 37.32,43.34 FB3.2
WCLK  (via drill 0.3)
  Top 0.254: R11.1 29.41,43.64 29.41,41.85 30.07,41.09 31.11,41.09 | 31.11,41.09 31.37,41.09 | 31.11,41.09 31.44,41.09 31.79,40.75 31.79,38.89 v32.13,38.55 | v34.75,38.46 35.69,37.53 35.69,35.47 34.65,34.43 U1.3
  Bottom 0.254: v32.13,38.55 32.22,38.46 v34.75,38.46
XTAL_OUT
  Top 0.203: MCLK.TP 38.6,39.62 R14.2
  Top 0.508: XTAL1.3 39.07,39.78 arc90 R14.2
(copper drawn outside any net)
  shapes: Bottom circle x4, Top circle x4

### Text on the board
tPlace: Line-In | Mic-In | Headset | Mic-In | Line-Out | Headset
tNames: DVDD | AVDD
bNames: DGND | 1. Use Switch S1 to turn ON/OFF MICBIAS / to Jacks J2 and J4 / 2. Inserting a 3 Pole audio Jack into J4 will / ground the MICBIAS Pin(19), SW1 of S1 / must be turned OFF before doing this. | BAK | AGND